# EAGLE design FDL-3 DCP - v1.3 (EAGLE 9.1.0)
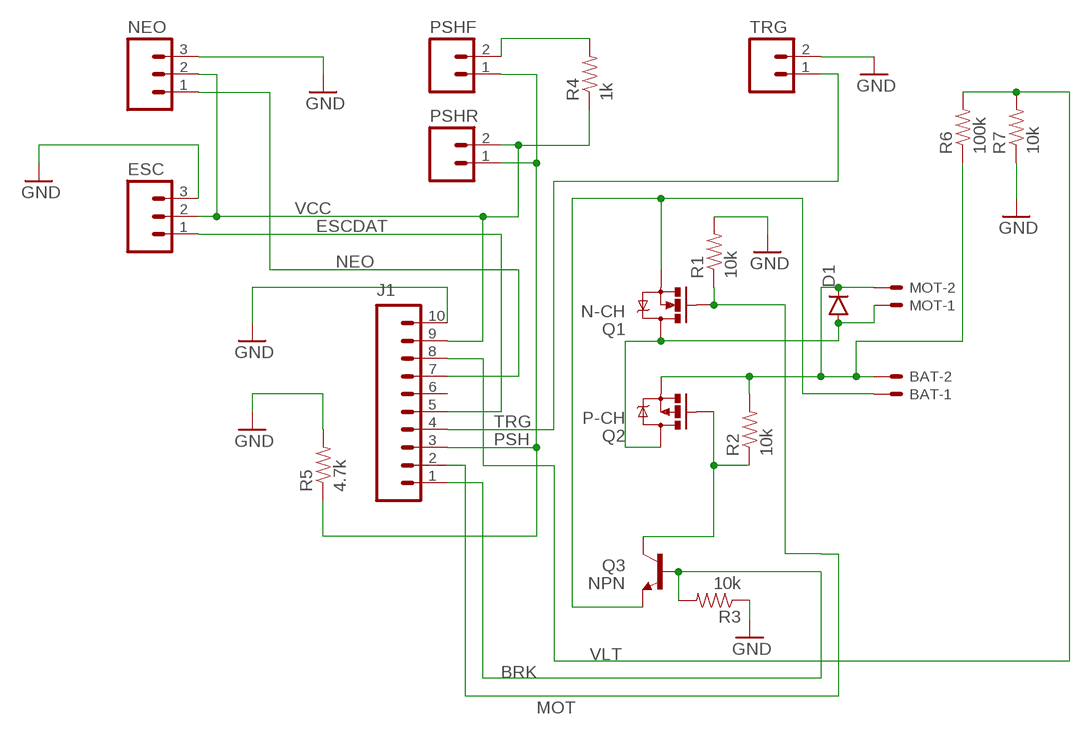
[diagram p0: schematic, sheet 1]

## Parts
BAT  JST-XH-02-PIN-LONG-PAD  [JST-XH-02-PACKAGE-LONG-PAD]
D1  DIODEPTH  [DIODE-1N4001]
ESC  M03PTH  [1X03]
J1  M10SILK_FEMALE_PTH  [1X10]
MOT  JST-XH-02-PIN-LONG-PAD  [JST-XH-02-PACKAGE-LONG-PAD]
NEO  M03PTH  [1X03]
PSHF  M02PTH  [1X02]
PSHR  M02PTH  [1X02]
Q1  N-CH  MOSFET-NCHANNELFQP30N06L  [TO220V]
Q2  P-CH  MOSFET-PCHANNELNDP6020P_20V_24A_LOW_VGS_TH  [TO220V]
Q3  NPN  TRANSISTOR_NPN2N3904  [TO-92]
R1  10k  10KOHM-1/4W-1%(PTH)HORIZ-KIT  [AXIAL-0.3EZ]
R2  10k  10KOHM-1/4W-1%(PTH)HORIZ-KIT  [AXIAL-0.3EZ]
R3  10k  10KOHM-1/4W-1%(PTH)HORIZ-KIT  [AXIAL-0.3EZ]
R4  1k  10KOHM-1/4W-1%(PTH)HORIZ-KIT  [AXIAL-0.3EZ]
R5  4.7k  10KOHM-1/4W-1%(PTH)HORIZ-KIT  [AXIAL-0.3EZ]
R6  100k  10KOHM-1/4W-1%(PTH)HORIZ-KIT  [AXIAL-0.3EZ]
R7  10k  10KOHM-1/4W-1%(PTH)HORIZ-KIT  [AXIAL-0.3EZ]
TRG  M02PTH  [1X02]

## Nets
BRK: J1.1 Q3.2(B) R3.P$2
ESCDAT: ESC.1 J1.5
GND: BAT.1 ESC.3 J1.10 NEO.3 Q1.3(S) Q3.1(E) R1.P$2 R3.P$1 R5.P$2 R7.P$1 TRG.2
MOT: J1.2 Q1.1(G) R1.P$1
N$2: Q2.1(G) Q3.3(C) R2.P$1
N$5: BAT.2 D1.C MOT.2 Q2.3(S) R2.P$2 R6.P$1
N$8: D1.A MOT.1 Q1.2(D) Q2.2(D)
N$10: PSHF.2 R4.P$2
NEO: J1.7 NEO.1
PSH: J1.3 PSHF.1 PSHR.1 R5.P$1
TRG: J1.4 TRG.1
VCC: ESC.2 J1.9 NEO.2 PSHR.2 R4.P$1
VLT: J1.8 R6.P$2 R7.P$2
Unconnected: J1.6

## Library data of the parts
BAT MOT = Rembrandt Electronics - JST XH Connectors v1-0:JST-XH-02-PIN: JST XH Connector 2 Pin Wire to board connector. Pitch: 2,54 mm, (0.100") Number of pins: 2 Created by Rembrandt Electronics www.rembrandtelectronics.com
D1 = SparkFun-DiscreteSemi:DIODE: Diode These are standard reverse protection diodes and small signal diodes. SMA package can handle up to about 1A. SOD-323 can handle about 200mA. What the SOD-323 package when ordering, there are some mfgs out there that are 5-pin packages.
ESC NEO = SparkFun-Connectors:M03: Header 3 Standard 3-pin 0.1" header. Use with straight break away headers (SKU : PRT-00116), right angle break away headers (PRT-00553), swiss pins (PRT-00743), machine pins (PRT-00117), and female headers (PRT-00115). Molex polarized connector foot print use with SKU : PRT-08232 with associated crimp pins and housings.
J1 = SparkFun-Connectors:M10: Header 10 Standard 10-pin 0.1" header. Use with straight break away headers (SKU : PRT-00116), right angle break away headers (PRT-00553), swiss pins (PRT-00743), machine pins (PRT-00117), and female headers (PRT-00115).; PROD_ID: CONN-11563
PSHF PSHR TRG = SparkFun-Connectors:M02: Standard 2-pin 0.1" header. Use with - straight break away headers ( PRT-00116) - right angle break away headers (PRT-00553) - swiss pins (PRT-00743) - machine pins (PRT-00117) - female headers (PRT-00115) Molex polarized connector foot print use with: PRT-08233 with associated crimp pins and housings. 2.54_SCREWTERM for use with PRT-10571. 3.5mm Screw Terminal footprints for PRT-08084 5mm Screw Terminal footprints for use with PRT-08432
Q1 = SparkFun-DiscreteSemi:MOSFET-NCHANNEL: Common NMOSFET Parts MFG P/N Store ID Prod ID FDD8780 TRANS-09984 SI7820DN TRANS-11055 FDS6630A IC-08089 2N7002PW TRANS-11151 FQP30N06L COM-10213 TRANS-10060 BSS123LT1G TRANS-08345 BSS138 TRANS-00830 BS170 2N7000; PROD_ID: TRANS-10060
Q2 = SparkFun-DiscreteSemi:MOSFET-PCHANNEL: Generic PMOSFET IRLML2244 - TRANS-11153 (SOT-23 -20V -4.3A) (1.Gate 2.Source 3.Drain) FQP27P06 - COM-10349 <http://www.sparkfun.com/products/10349> (TO-220 -60V -27A) (1.Gate 2.Source 3.Drain); PROD_ID: TRANS-13060
Q3 = SparkFun-DiscreteSemi:TRANSISTOR_NPN: Generic NPN BJT MMBT2222A - TRANS-08049 (SOT-23, 1A 40V) MPSA42 - TRANS-09116 (SOT-23, 500mA 300V) MMBT5088LT1G - TRANS-11160 (SOT-23, 50 mA 30V) BC547 - COM-08928 <http://www.sparkfun.com/products/8928> (TO-92 45V 100mA) (1.Collector 2.Base 3.Emitter) 2N3904 - COM-00521 <http://www.sparkfun.com/products/521> (TO-92 40V 200mA) (1.Emitter 2.Base 3.Collector) P2N2222A - COM-12852 <http://www.sparkfun.com/products/12852> (TO-92 40V 600mA) (1.Collector 2.Base 3.Emitter); PROD_ID: TRANS-08447
R1-R3 R7 = SparkFun-Resistors:10KOHM-1/4W-1%(PTH): RES-12183; PROD_ID: RES-12183
R4-R6 = SparkFun-Resistors:10KOHM-1/4W-1%(PTH): RES-12183; PROD_ID: RES-12183; VALUE: 10k

## Board
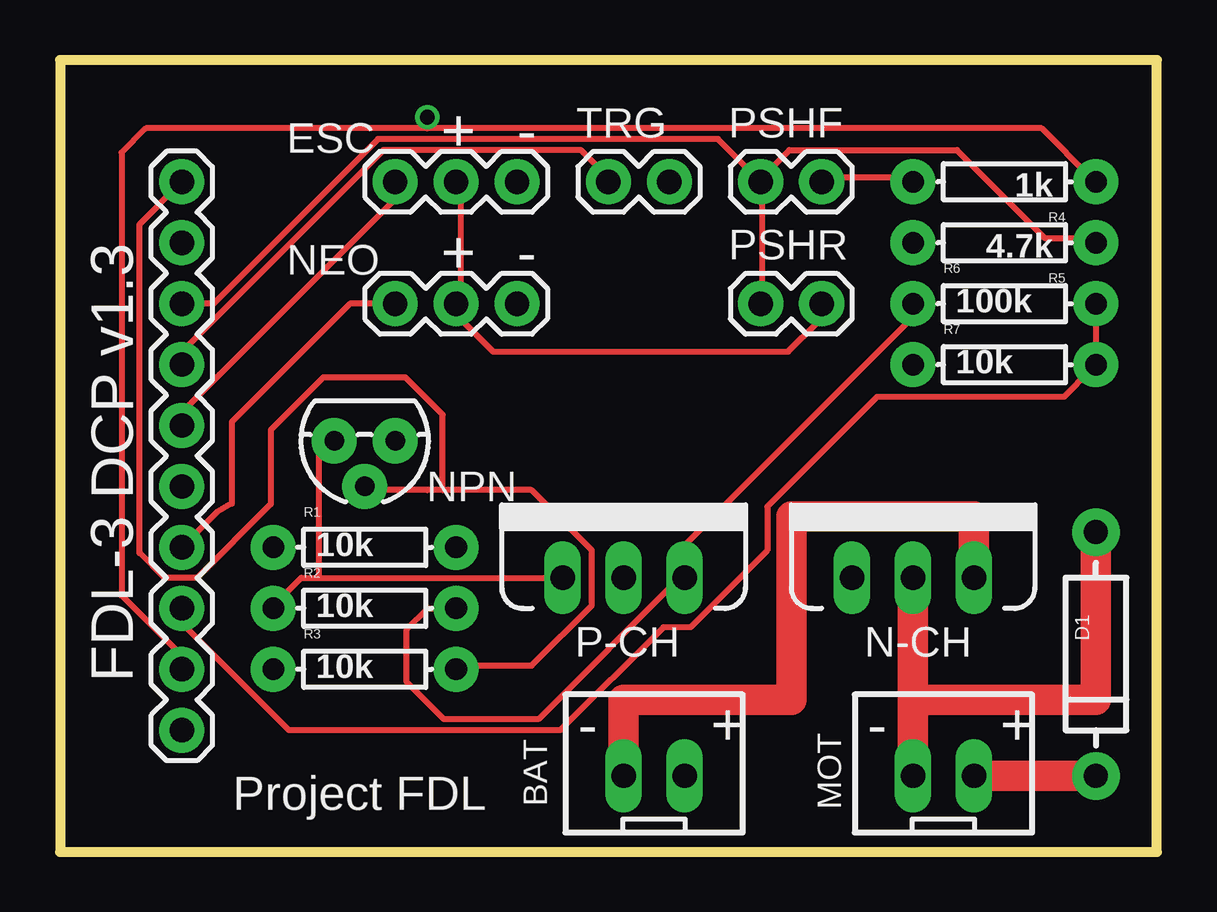
[diagram p1: board, top side]
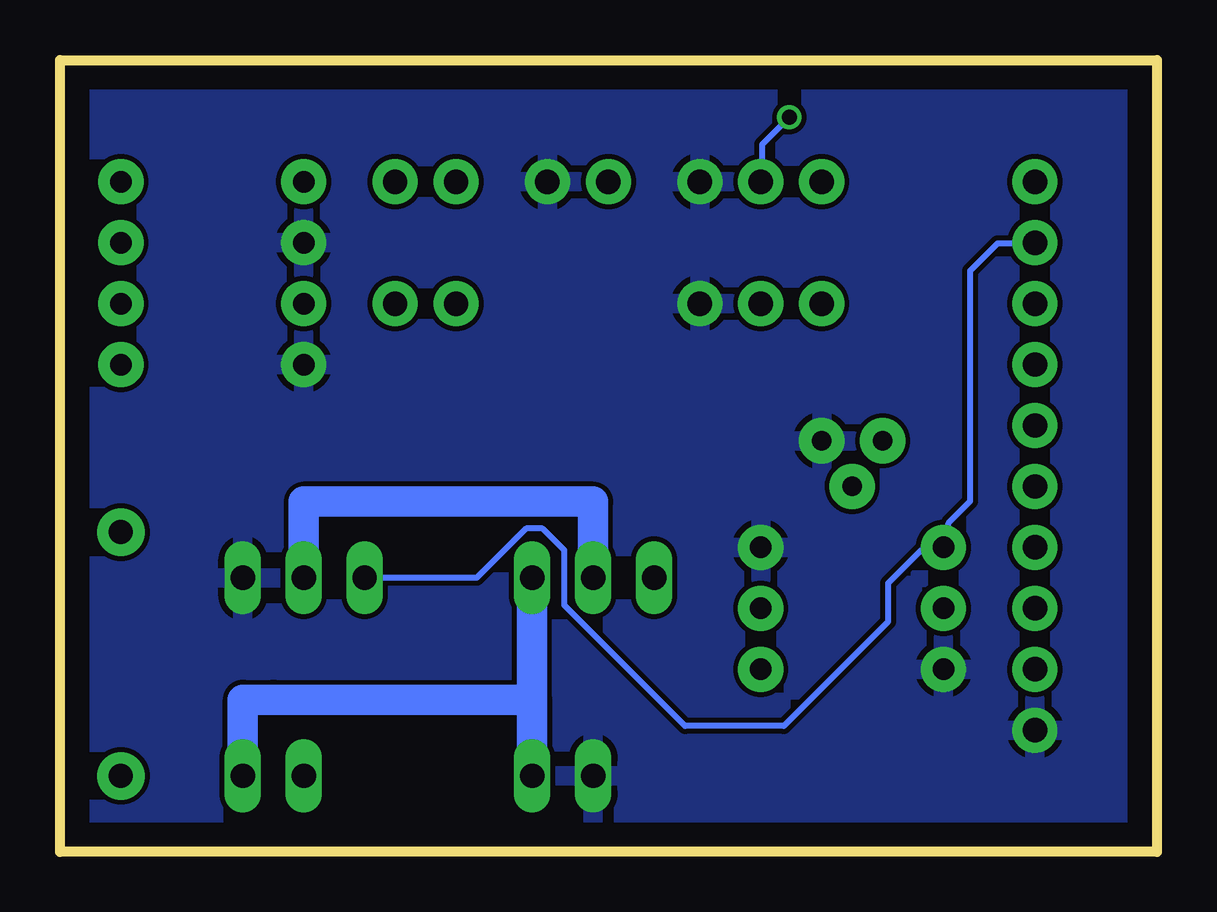
[diagram p2: board, bottom side, seen from below]

Size 45.72 x 33.02 mm. Coordinates in mm from the lower left corner, seen from the top.
Outline: 0,0 45.72,0 45.72,33.02 0,33.02 0,0
Copper layers (1*16): Top 0.035mm / dielectric 1.5mm / Bottom 0.035mm
Design rules "default": minimum track width 10mil, minimum drill 24mil, track to track 8mil, track to pad 8mil, pad to pad 8mil, via to via 8mil, smd to smd 8mil, copper to edge 40mil, drill to drill 8mil, minimum pad ring 10mil, minimum via ring 8mil, stop-mask expansion 4mil, vias tented up to drill 0mil, thermal gap 10mil

### Footprints (pad centres in the part's own frame; a part is rotated, then mirrored left to right if it is on the bottom)
JST-XH-02-PACKAGE-LONG-PAD = drill 1.016 long: 1 -1.27,0; 2 1.27,0
DIODE-1N4001 = drill 1 pad 1.981: A -5.08,0; C 5.08,0
1X03 = drill 1.016 pad 1.88: 1 0,0; 2 2.54,0; 3 5.08,0
1X10 = drill 1.016 pad 1.88: 1 0,0; 2 2.54,0; 3 5.08,0; 4 7.62,0; 5 10.16,0; 6 12.7,0; 7 15.24,0; 8 17.78,0; 9 20.32,0; 10 22.86,0
1X02 = drill 1.016 pad 1.88: 1 0,0; 2 2.54,0
TO220V = drill 1.016 long: 1 -2.54,0; 2 0,0; 3 2.54,0
TO-92 = drill 0.813 pad 1.88: 1 -1.27,0; 2 0,1.905; 3 1.27,0
AXIAL-0.3EZ = drill 0.9 pad 1.88: P$1 -3.81,0; P$2 3.81,0

### Placement (x,y rotation side)
BAT  24.77,3.17 0 top
D1  43.18,8.26 270 top
ESC  13.97,27.94 0 top
J1  5.08,27.94 270 top
MOT  36.83,3.17 0 top
NEO  13.97,22.86 0 top
PSHF  29.21,27.94 0 top
PSHR  29.21,22.86 0 top
Q1  35.56,11.43 0 top
Q2  23.5,11.43 0 top
Q3  12.7,17.14 180 top
R1  12.7,12.7 0 top
R2  12.7,10.16 0 top
R3  12.7,7.62 0 top
R4  39.37,27.94 180 top
R5  39.37,25.4 180 top
R6  39.37,22.86 0 top
R7  39.37,20.32 0 top
TRG  22.86,27.94 0 top

### Tracks (layer width: path | path; a pad name or v marks a point on that pad's centre or on a via)
BRK
  Top 0.254: 15.95,15.09 19.66,15.09 22.17,12.57 22.17,10.29 19.66,7.77 16.69,7.77 R3.P$2 | Q3.2 12.8,15.09 15.32,15.09 15.95,15.09 | J1.1 3.31,26.18 3.31,12.46 4.34,11.43 5.71,11.43 8.79,14.5 8.79,17.6 10.97,19.79 14.4,19.79 15.95,18.24 15.95,15.09
ESCDAT
  Top 0.254: J1.5 5.26,17.83 5.26,18.52 13.95,27.2 13.95,27.89 ESC.1
GND
  Top 1.27: BAT.1 23.5,6.35 30.48,6.35 30.48,13.99 38.1,13.99 Q1.3
  pour Bottom: 0,0 45.72,0 45.72,33.02 0,33.02
MOT
  Bottom 0.254: 5.26,25.38 J1.2 5.26,25.38 | Q1.1 32.92,11.43 28.35,11.43 26.29,13.49 25.6,13.49 24.69,12.57 24.69,10.29 19.66,5.26 15.54,5.26 11.2,9.6 11.2,11.2 9.83,12.57 8.91,12.57 R1.P$1 8.69,12.8 8.69,13.72 7.77,14.63 7.77,24.23 6.63,25.38 5.26,25.38
N$2
  Top 0.254: 10.79,11.43 10.06,11.43 8.91,10.29 R2.P$1 | 10.79,11.43 20.8,11.43 Q2.1 | 10.79,11.43 10.79,16.51 Q3.3
N$5
  Top 0.254: R6.P$1 35.43,22.86 35.43,22.17 26.06,12.8 26.06,11.43 Q2.3 25.83,11.43 19.94,5.54 16,5.54 14.45,7.09 14.45,9.27 15.34,10.16 R2.P$2
  Top 1.27: MOT.2 D1.C
  Bottom 1.27: MOT.2 38.1,6.35 36.83,6.35 26.04,6.35 BAT.2 Q2.3
N$8
  Top 1.27: MOT.1 35.56,6.35 | 35.56,6.35 43.18,6.35 D1.A | 35.56,6.35 Q1.2
  Bottom 1.27: Q2.2 23.5,14.61 35.56,14.61 Q1.2
N$10
  Top 0.254: PSHF.2 31.77,28.12 35.43,28.12 R4.P$2
NEO
  Top 0.254: NEO.1 12.09,22.86 7.16,17.93 7.16,14.53 6.56,14.18 J1.7
PSH
  Top 0.254: J1.3 5.26,22.86 6.4,22.86 13.26,29.72 27.43,29.72 29.03,28.12 PSHF.1 | PSHR.1 29.26,22.86 29.26,27.89 PSHF.1 | R5.P$1 42.98,25.6 41.05,25.6 37.39,29.26 30.4,29.26 29.26,28.12 PSHF.1
TRG
  Top 0.254: J1.4 5.26,20.34 5.26,21.03 13.49,29.26 21.72,29.26 22.86,28.12 TRG.1
VCC  (via drill 0.61)
  Top 0.254: 16.69,22.86 16.69,27.89 ESC.2 | 16.69,22.86 NEO.2 16.69,22.86 | PSHR.2 31.55,22.86 31.55,22.05 30.35,20.85 18.06,20.85 16.69,22.23 16.69,22.86 | 15.32,30.18 40.92,30.18 42.98,28.12 R4.P$1 | 15.32,30.18 3.58,30.18 2.56,29.16 2.56,10.69 5.03,8.23 5.03,7.77 J1.9 | 15.32,30.18 v15.32,30.63
  Bottom 0.254: v15.32,30.63 16.46,29.49 16.46,28.12 ESC.2
VLT
  Top 0.254: J1.8 5.26,10.06 5.26,9.37 9.55,5.08 20.85,5.08 25.15,9.37 26.29,9.37 29.49,12.57 29.49,14.4 34.06,18.97 41.83,18.97 42.98,20.12 R7.P$2 43.2,20.34 43.2,22.86 R6.P$2

### Text on the board
tPlace: + | - | + | - | - | -
tNames: FDL-3 DCP v1.3 | + | + | Project FDL